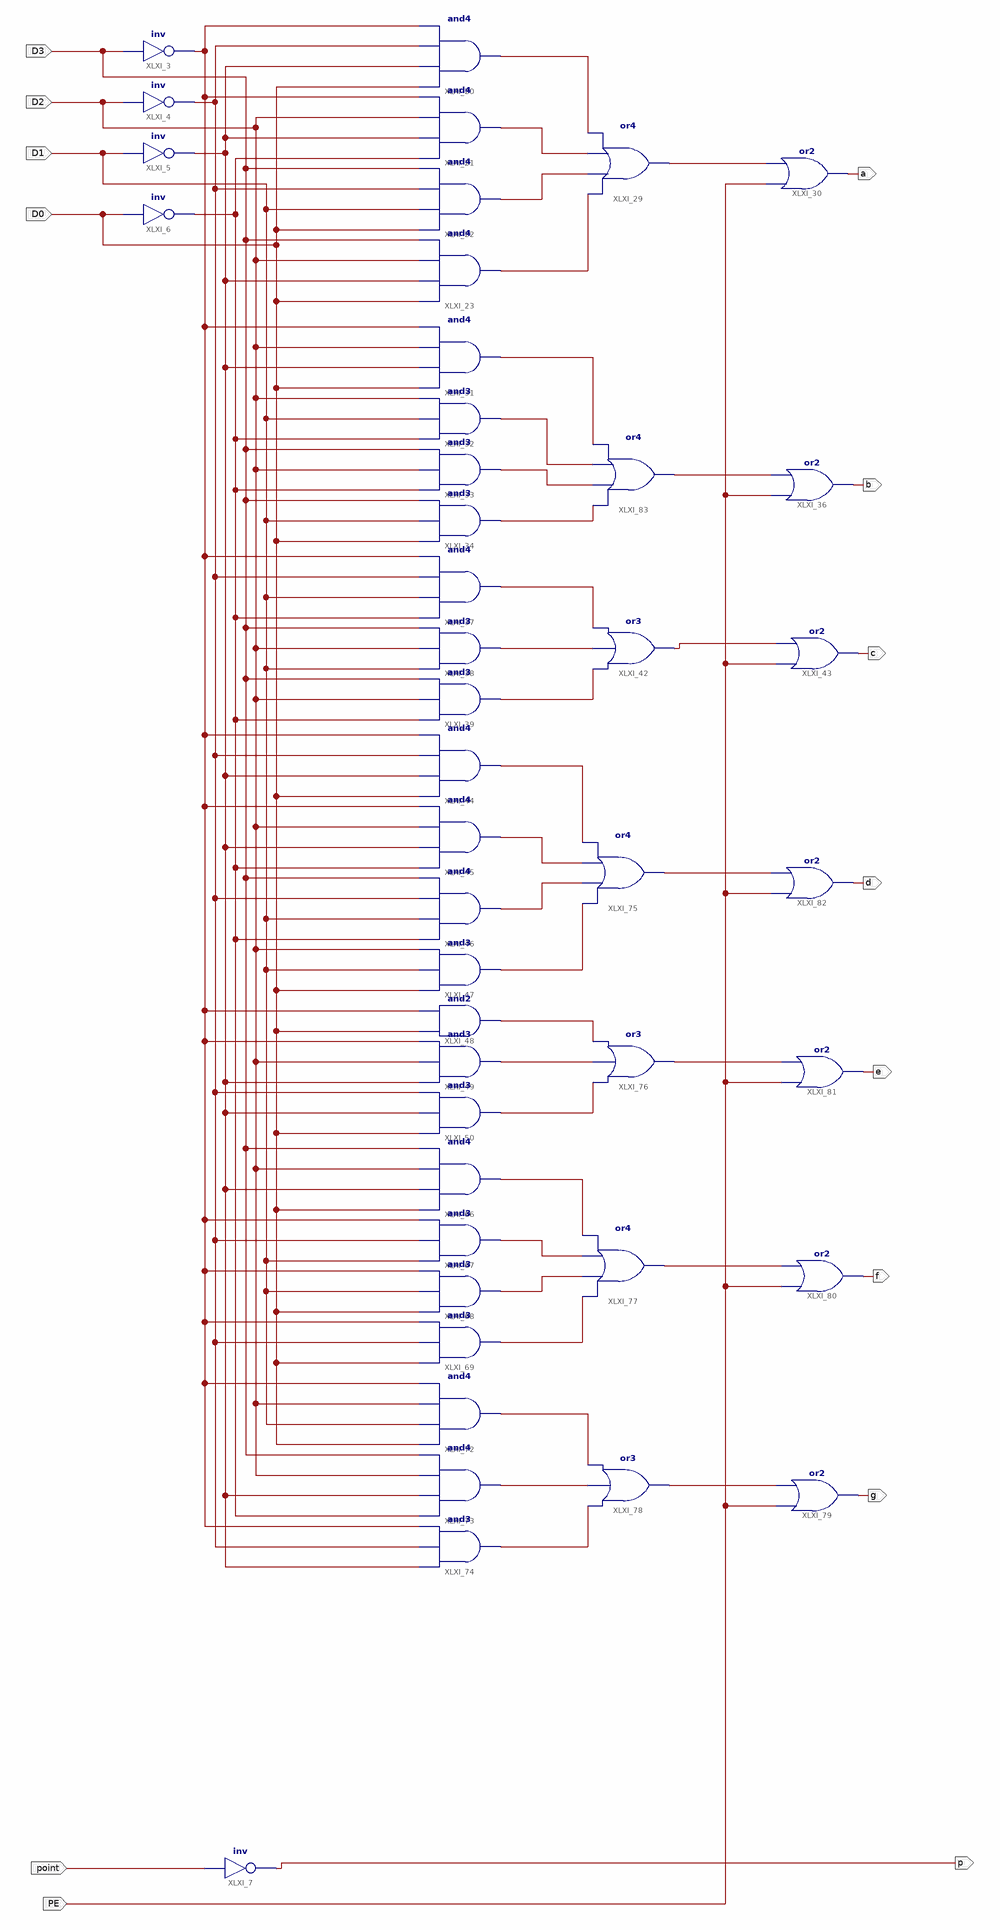
[diagram p0: schematic sheet 1]
// Xilinx ISE schematic Hex27SegDecoder_sch.sch (kintex7) as structural Verilog: 44 symbols, 14 ports
module Hex27SegDecoder_sch (
  input  D3,
  input  D2,
  input  D1,
  input  D0,
  input  point,
  input  PE,
  output p,
  output a,
  output b,
  output c,
  output d,
  output e,
  output f,
  output g
);

  wire XLXN_52, XLXN_54, XLXN_55, XLXN_56, XLXN_63, XLXN_64, XLXN_65, XLXN_66, XLXN_67, XLXN_71, XLXN_77,
       XLXN_78, XLXN_79, XLXN_80, XLXN_93, XLXN_95, XLXN_96, XLXN_97, XLXN_98, XLXN_99, XLXN_100, XLXN_101,
       XLXN_102, XLXN_103, XLXN_104, XLXN_105, XLXN_106, XLXN_107, XLXN_108, XLXN_109, XLXN_110, XLXN_111,
       XLXN_130, XLXN_131, XLXN_132, XLXN_133;

  not XLXI_3 (XLXN_52, D3);
  not XLXI_6 (XLXN_56, D0);
  not XLXI_5 (XLXN_55, D1);
  not XLXI_4 (XLXN_54, D2);
  and XLXI_21 (XLXN_64, XLXN_56, XLXN_55, D2, XLXN_52);
  and XLXI_22 (XLXN_65, D0, D1, XLXN_54, D3);
  and XLXI_23 (XLXN_66, D0, XLXN_55, D2, D3);
  and XLXI_20 (XLXN_63, D0, XLXN_55, XLXN_54, XLXN_52);
  or XLXI_29 (XLXN_67, XLXN_66, XLXN_65, XLXN_64, XLXN_63);
  or XLXI_30 (a, PE, XLXN_67);
  and XLXI_31 (XLXN_130, D0, XLXN_55, D2, XLXN_52);
  and XLXI_32 (XLXN_131, XLXN_56, D1, D2);
  and XLXI_33 (XLXN_132, XLXN_56, D2, D3);
  and XLXI_34 (XLXN_133, D0, D1, D3);
  or XLXI_36 (b, PE, XLXN_71);
  and XLXI_37 (XLXN_77, XLXN_56, D1, XLXN_54, XLXN_52);
  and XLXI_38 (XLXN_78, D1, D2, D3);
  and XLXI_39 (XLXN_79, XLXN_56, D2, D3);
  or XLXI_42 (XLXN_80, XLXN_79, XLXN_78, XLXN_77);
  or XLXI_43 (c, PE, XLXN_80);
  and XLXI_44 (XLXN_93, D0, XLXN_55, XLXN_54, XLXN_52);
  and XLXI_45 (XLXN_95, XLXN_56, XLXN_55, D2, XLXN_52);
  and XLXI_46 (XLXN_96, XLXN_56, D1, XLXN_54, D3);
  and XLXI_47 (XLXN_97, D0, D1, D2);
  and XLXI_48 (XLXN_98, D0, XLXN_52);
  and XLXI_49 (XLXN_99, XLXN_55, D2, XLXN_52);
  and XLXI_50 (XLXN_100, D0, XLXN_55, XLXN_54);
  and XLXI_66 (XLXN_101, D0, XLXN_55, D2, D3);
  and XLXI_67 (XLXN_102, D1, XLXN_54, XLXN_52);
  and XLXI_68 (XLXN_103, D0, D1, XLXN_52);
  and XLXI_69 (XLXN_104, D0, XLXN_54, XLXN_52);
  not XLXI_7 (p, point);
  and XLXI_72 (XLXN_105, D0, D1, D2, XLXN_52);
  and XLXI_73 (XLXN_106, XLXN_56, XLXN_55, D2, D3);
  and XLXI_74 (XLXN_107, XLXN_55, XLXN_54, XLXN_52);
  or XLXI_75 (XLXN_111, XLXN_97, XLXN_96, XLXN_95, XLXN_93);
  or XLXI_76 (XLXN_110, XLXN_100, XLXN_99, XLXN_98);
  or XLXI_77 (XLXN_109, XLXN_104, XLXN_103, XLXN_102, XLXN_101);
  or XLXI_78 (XLXN_108, XLXN_107, XLXN_106, XLXN_105);
  or XLXI_79 (g, PE, XLXN_108);
  or XLXI_80 (f, PE, XLXN_109);
  or XLXI_81 (e, PE, XLXN_110);
  or XLXI_82 (d, PE, XLXN_111);
  or XLXI_83 (XLXN_71, XLXN_133, XLXN_132, XLXN_131, XLXN_130);
endmodule
